# EAGLE design encoder (EAGLE 9.5.2)
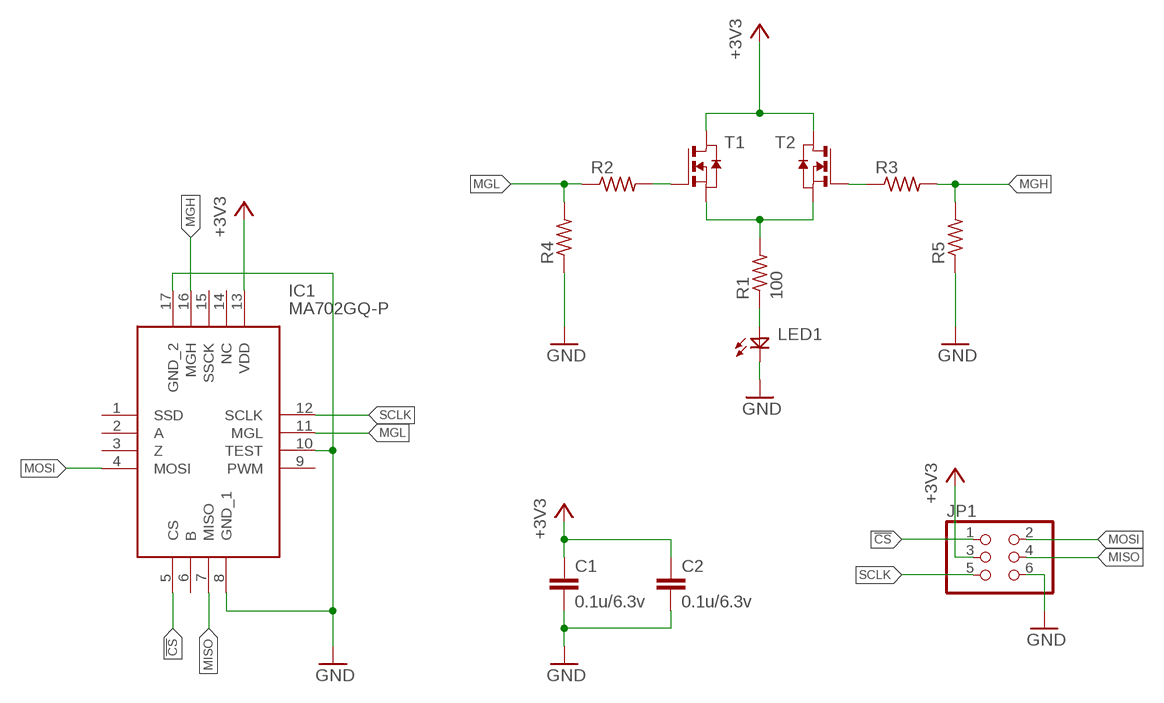
[diagram p0: schematic, sheet 1]

## Parts
C1  0.1u/6.3v  C-EUC0603  [C0603]
C2  0.1u/6.3v  C-EUC0603  [C0603]
IC1  MA702GQ-P  [QFN50P300X300X100-17N]
JP1  PINHD-2X3/90  [2X03/90]
LED1  LED1608  [LED1608]
R1  100  R-US_R0603  [R0603]
R2  R-US_R0603  [R0603]
R3  R-US_R0603  [R0603]
R4  R-US_R0603  [R0603]
R5  R-US_R0603  [R0603]
T1  NMOSSOT23  [SOT-23]
T2  NMOSSOT23  [SOT-23]

## Nets
!CS: IC1.5(CS) JP1.1
+3V3: C1.1 C2.1 IC1.13(VDD) JP1.3 T1.1(D) T2.1(D)
GND: C1.2 C2.2 IC1.8(GND_1) IC1.10(TEST) IC1.17(GND_2) JP1.6 LED1.K R4.1 R5.1
MGH: IC1.16(MGH) R3.2 R5.2
MGL: IC1.11(MGL) R2.1 R4.2
MISO: IC1.7(MISO) JP1.4
MOSI: IC1.4(MOSI) JP1.2
N$1: LED1.A R1.1
N$2: R1.2 T1.2(S) T2.2(S)
N$3: R2.2 T1.3(G)
N$4: R3.1 T2.3(G)
SCLK: IC1.12(SCLK) JP1.5
Unconnected: IC1.1(SSD) IC1.2(A) IC1.3(Z) IC1.6(B) IC1.9(PWM) IC1.14(NC) IC1.15(SSCK)

## Library data of the parts
C1 C2 = rcl:C-EU: CAPACITOR, European symbol; SPICEPREFIX: C
IC1 = MA702GQ-P:MA702GQ-P: Board Mount Hall Effect / Magnetic Sensors 12-bit, digital, contactless angle sensor with ABZ incremental & PWM outputs Source: Datasheet <https://www.monolithicpower.com/pub/media/document/m/a/ma702_r1.0.pdf>; DESCRIPTION: Board Mount Hall Effect / Magnetic Sensors 12-bit, digital, contactless angle sensor with ABZ incremental & PWM outputs; HEIGHT: 1mm; MANUFACTURER_NAME: Monolithic Power Systems (MPS); MANUFACTURER_PART_NUMBER: MA702GQ-P
JP1 = pinhead:PINHD-2X3: PIN HEADER
LED1 = MotorDriver:LED
R1-R5 = rcl:R-US_: RESISTOR, American symbol; SPICEPREFIX: R
T1 T2 = zetex:NMOSSOT23: MOS FET; OC_FARNELL: unknown; OC_NEWARK: unknown

## Board
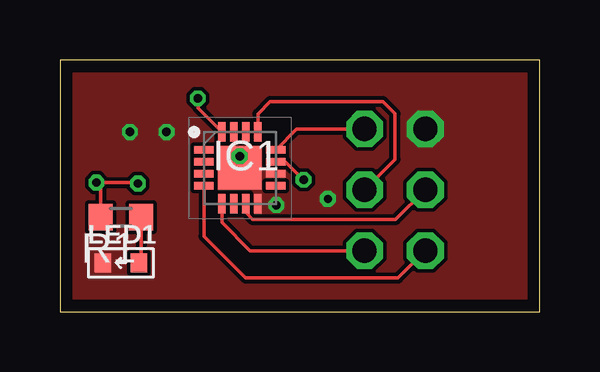
[diagram p1: board, top side]
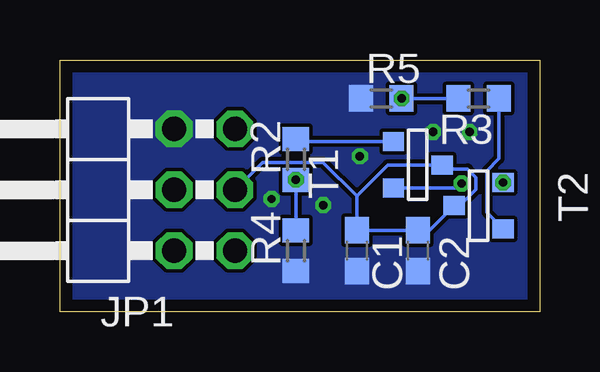
[diagram p2: board, bottom side, seen from below]

Size 20 x 10.5 mm. Coordinates in mm from the lower left corner, seen from the top.
Outline: 0,0 20,0 20,10.5 0,10.5 0,0
Copper layers (1*16): Top 0.035mm / dielectric 1.6mm / Bottom 0.035mm
Design rules "Elecrow_2-layer_PCB_eagle_rule": minimum track width 6mil, minimum drill 12mil, track to track 6mil, track to pad 6mil, pad to pad 6mil, via to via 8mil, smd to smd 0mil, copper to edge 20mil, drill to drill 10mil, minimum pad ring 6mil, minimum via ring 6mil, stop-mask expansion 0mil, vias tented up to drill 100mil, thermal gap 10mil

### Footprints (pad centres in the part's own frame; a part is rotated, then mirrored left to right if it is on the bottom)
C0603 = smd 1.1 x 1: 1 -0.85,0; 2 0.85,0
QFN50P300X300X100-17N = smd 0.8 x 0.3: 1 -1.5,0.75; 2 -1.5,0.25; 3 -1.5,-0.25; 4 -1.5,-0.75; 9 1.5,-0.75; 10 1.5,-0.25; 11 1.5,0.25; 12 1.5,0.75 | smd 0.3 x 0.8: 5 -0.75,-1.5; 6 -0.25,-1.5; 7 0.25,-1.5; 8 0.75,-1.5; 13 0.75,1.5; 14 0.25,1.5; 15 -0.25,1.5; 16 -0.75,1.5 | smd 1.8 x 1.8: 17 0,0
2X03/90 = drill 1.016 octagon: 1 -2.54,-6.35; 2 -2.54,-3.81; 3 0,-6.35; 4 0,-3.81; 5 2.54,-6.35; 6 2.54,-3.81
LED1608 = smd 0.7 x 0.8: A 0.75,0; K -0.75,0
R0603 = smd 1 x 1.1: 1 -0.85,0; 2 0.85,0
SOT-23 = smd 0.787 x 0.889: 1 0.025,-1.016; 2 -0.94,1.016; 3 0.991,1.016

### Placement (x,y rotation side)
C1  7.62,2.54 270 bottom
C2  5.08,2.54 270 bottom
IC1  7.5,6 0 top
JP1  19.05,5.08 90 bottom
LED1  2.54,2.03 0 top
R1  2.54,3.94 180 top
R2  10.16,6.35 90 bottom
R3  2.54,8.89 180 bottom
R4  10.16,2.54 90 bottom
R5  6.6,8.89 0 bottom
T1  5.08,6.1 90 bottom
T2  2.54,4.45 270 bottom

### Tracks (layer width: path | path; a pad name or v marks a point on that pad's centre or on a via)
!CS
  Top 0.152: IC1.5 6.75,3.71 7.92,2.54 JP1.1
+3V3
  Top 0.152: JP1.3 13.97,6.35 13.97,8.26 13.46,8.76 8.76,8.76 8.25,8.25 IC1.13
  Bottom 0.152: 7.62,4.83 C1.1 C2.1 4.59,3.39 T2.1 3.32,4.42 2.65,5.09 2.65,5.59 3,5.95 3.89,5.95 T1.1 6.33,6.12 7.62,4.83 | 7.62,4.83 9.02,6.23 11.55,6.23 JP1.3
GND  (via drill 0.35)
  other vias: 11.18,4.7 2.92,7.49 4.45,7.49 9.02,4.45 7.49,6.48
  pour Top (rank 5, no thermals): -3.17,-1.91 28.19,-1.91 28.19,28.45 -3.17,28.45
  pour Bottom (rank 5, no thermals): -5.84,-4.83 25.53,-4.83 25.53,25.53 -5.84,25.53
MGH  (via drill 0.35)
  Top 0.152: IC1.16 5.75,8.5 R5.2
  Bottom 0.152: R5.2 R3.2
  other vias: 5.75,8.89
MGL  (via drill 0.35)
  Top 0.152: IC1.11 9.41,6.25 R2.1
  Bottom 0.152: R2.1 R4.2
  other vias: 10.16,5.5
MISO
  Top 0.152: IC1.7 7.75,4.13 8.04,3.83 13.99,3.83 JP1.4
MOSI
  Top 0.152: IC1.4 6,3.14 7.75,1.4 14.1,1.4 JP1.2
N$1
  Top 0.152: R1.1 3.39,2.13 LED1.A
N$2  (via drill 0.35)
  Top 0.152: v3.25,5.34 3.21,5.38 T2.2 1.69,5.22 R1.2
  Bottom 0.152: v3.25,5.34 3.44,5.16 T1.2
  other vias: 1.52,5.38
N$3
  Bottom 0.152: T1.3 10.05,7.09 R2.2
N$4
  Bottom 0.152: R3.1 1.69,6.38 2.2,5.87 2.2,4.13 T2.3
SCLK
  Top 0.152: IC1.12 9.87,7.62 JP1.5